# Altium schematic sheet muC.SchDoc
size A3; Organization: asdf; Address1: asdf; Revision: 1
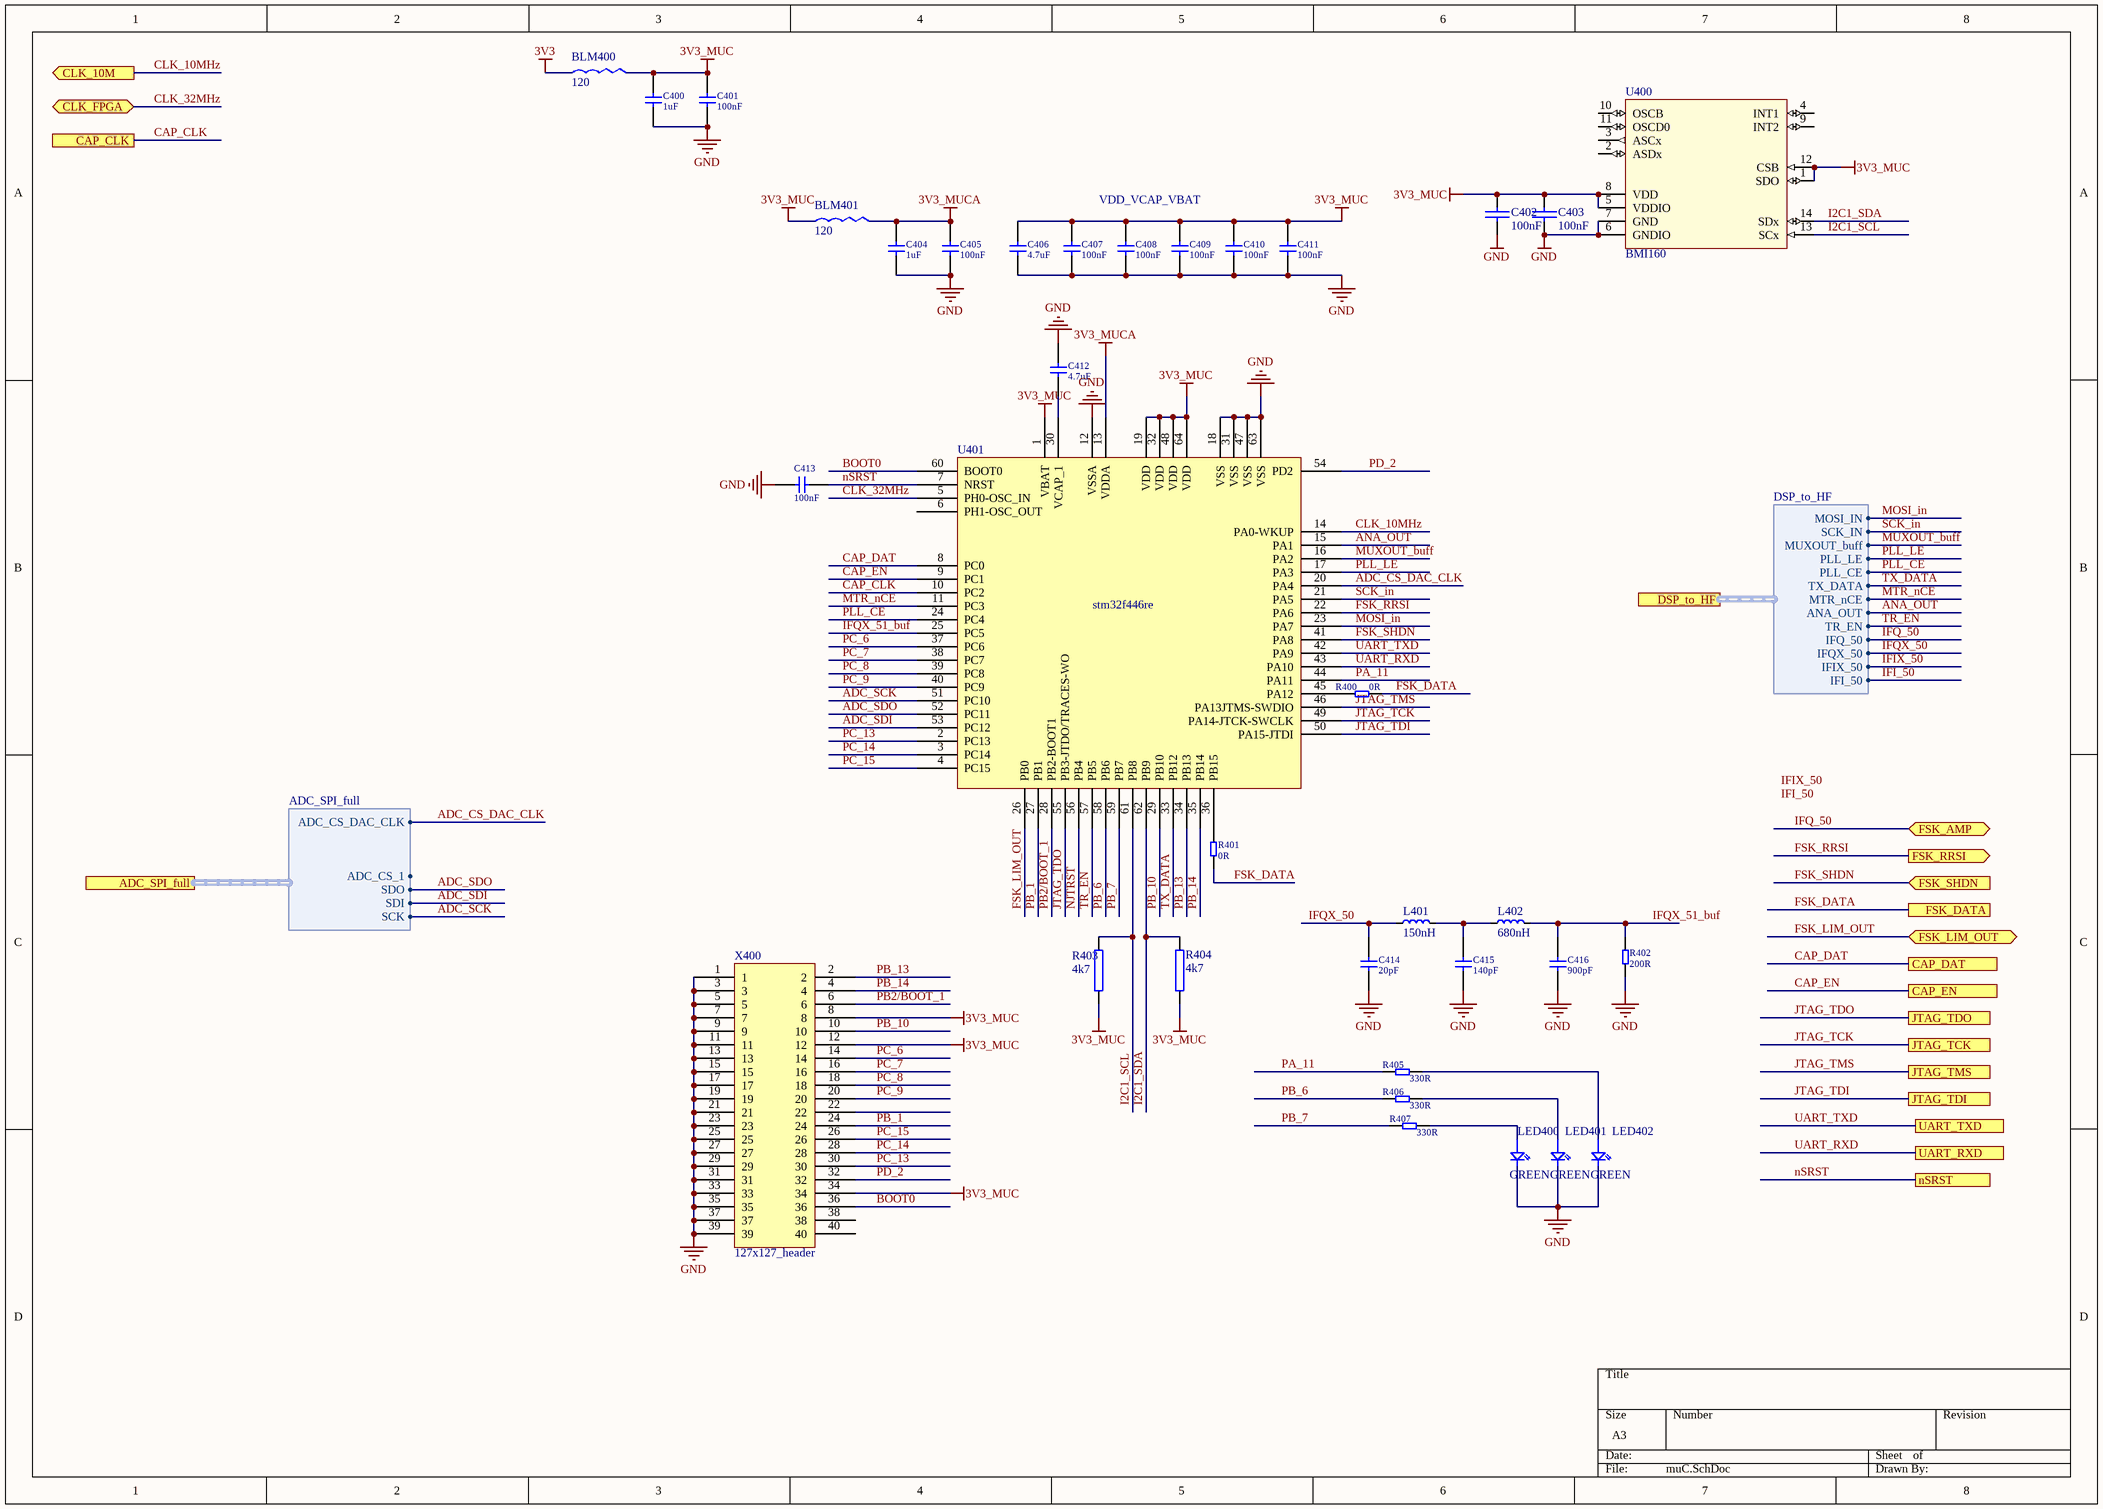
[diagram p0: muC.SchDoc]

## Parts
BLM400  FerriteBeat  [BLM18SG121TN1]  (value not drawn)
BLM401  FerriteBeat  [BLM18SG121TN1]  (value not drawn)
C400  value 1uF  [C_SMD_0603]  (hidden comment: SMD capacitor)
C401  value 100nF  [C_SMD_0402]  (hidden comment: SMD capacitor)
C402  100nF  [0402RN]
C403  100nF  [0402RN]
C404  value 1uF  [C_SMD_0603]  (hidden comment: SMD capacitor)
C405  value 100nF  [C_SMD_0402]  (hidden comment: SMD capacitor)
C406  value 4.7uF  [C_SMD_0603]  (hidden comment: SMD capacitor)
C407  value 100nF  [C_SMD_0402]  (hidden comment: SMD capacitor)
C408  value 100nF  [C_SMD_0402]  (hidden comment: SMD capacitor)
C409  value 100nF  [C_SMD_0402]  (hidden comment: SMD capacitor)
C410  value 100nF  [C_SMD_0402]  (hidden comment: SMD capacitor)
C411  value 100nF  [C_SMD_0402]  (hidden comment: SMD capacitor)
C412  value 4.7uF  [C_SMD_0603]  (hidden comment: SMD capacitor)
C413  value 100nF  [C_SMD_0402]  (hidden comment: SMD capacitor)
C414  value 20pF  [C_SMD_0402]  (hidden comment: SMD capacitor)
C415  value 140pF  [C_SMD_0402]  (hidden comment: SMD capacitor)
C416  value 900pF  [C_SMD_0402]  (hidden comment: SMD capacitor)
L401  150nH  [L_0805]
L402  680nH  [L_0805]
LED400  KPHHS-1005  [R_SMD_0402]  (value not drawn)
LED401  KPHHS-1005  [R_SMD_0402]  (value not drawn)
LED402  KPHHS-1005  [R_SMD_0402]  (value not drawn)
R400  value 0R  [R_SMD_0402]  (hidden comment: SMD Resistor)
R401  value 0R  [R_SMD_0402]  (hidden comment: SMD Resistor)
R402  value 200R  [R_SMD_0402]  (hidden comment: SMD Resistor)
R403  4k7  [0402RN]
R404  4k7  [0402RN]
R405  value 330R  [R_SMD_0402]  (hidden comment: SMD Resistor)
R406  value 330R  [R_SMD_0402]  (hidden comment: SMD Resistor)
R407  value 330R  [R_SMD_0402]  (hidden comment: SMD Resistor)
U400  BMI160  [BMI160]
U401  stm32f446re  [LQFP64]
X400  127x127_header  [Header_127x127_40PIN]

## Ports
ADC_SPI_full (harness ADC_SPI_full), CAP_CLK, CAP_DAT, CAP_EN, CLK_10M (out), CLK_FPGA (bidir), DSP_to_HF (harness DSP_to_HF), FSK_AMP (bidir), FSK_DATA, FSK_LIM_OUT (bidir), FSK_RRSI (out), FSK_SHDN (in), JTAG_TCK, JTAG_TDI, JTAG_TDO, JTAG_TMS, nSRST, UART_RXD, UART_TXD

## Harnesses
DSP_to_HF: MOSI_IN, SCK_IN, MUXOUT_buff, PLL_LE, PLL_CE, TX_DATA, MTR_nCE, ANA_OUT, TR_EN, IFQ_50, IFQX_50, IFIX_50, IFI_50
ADC_SPI_full: ADC_CS_1, SDO, SDI, SCK, ADC_CS_DAC_CLK

## Nets
3V3: BLM400.1
3V3_MUC: BLM400.2 BLM401.1 C400.1 C401.1 C402.1 C403.1 C406.1 C407.1 C408.1 C409.1 C410.1 C411.1 R403.1 R404.1 U400.1(SDO) U400.5(VDDIO) U400.8(VDD) U400.12(CSB) U401.1(VBAT) U401.19(VDD) U401.32(VDD) U401.48(VDD) U401.64(VDD) X400.8 X400.12 X400.34
3V3_MUCA: BLM401.2 C404.1 C405.1 U401.13(VDDA)
GND: C400.2 C401.2 C402.2 C403.2 C404.2 C405.2 C406.2 C407.2 C408.2 C409.2 C410.2 C411.2 C412.2 C413.2 C414.2 C415.2 C416.2 LED400.2 LED401.2 LED402.2 R402.2 U400.6(GNDIO) U400.7(GND) U401.12(VSSA) U401.18(VSS) U401.31(VSS) U401.47(VSS) U401.63(VSS) X400.1 X400.3 X400.5 X400.7 X400.9 X400.11 X400.13 X400.15 X400.17 X400.19 X400.21 X400.23 X400.25 X400.27 X400.29 X400.31 X400.33 X400.35 X400.37 X400.39
ADC_CS_DAC_CLK: U401.20(PA4) ; port ADC_SPI_full.ADC_CS_DAC_CLK
ADC_SCK: U401.51(PC10) ; port ADC_SPI_full.SCK
ADC_SDI: U401.53(PC12) ; port ADC_SPI_full.SDI
ADC_SDO: U401.52(PC11) ; port ADC_SPI_full.SDO
ANA_OUT: U401.15(PA1) ; port DSP_to_HF.ANA_OUT
BOOT0: U401.60(BOOT0) X400.36
CAP_CLK: U401.10(PC2) ; port CAP_CLK
CAP_DAT: U401.8(PC0) ; port CAP_DAT
CAP_EN: U401.9(PC1) ; port CAP_EN
CLK_10MHz: U401.14(PA0-WKUP) ; port CLK_10M
CLK_32MHz: U401.5(PH0-OSC_IN) ; port CLK_FPGA
FSK_DATA: R400.1 R401.2 ; port FSK_DATA
FSK_LIM_OUT: U401.26(PB0) ; port FSK_LIM_OUT
FSK_RRSI: U401.22(PA6) ; port FSK_RRSI
FSK_SHDN: U401.41(PA8) ; port FSK_SHDN
I2C1_SCL: R403.2 U400.13(SCx) U401.61(PB8)
I2C1_SDA: R404.2 U400.14(SDx) U401.62(PB9)
IFI_50: port DSP_to_HF.IFI_50
IFIX_50: port DSP_to_HF.IFIX_50
IFQ_50: port FSK_AMP, port DSP_to_HF.IFQ_50
IFQX_50: C414.1 L401.2 ; port DSP_to_HF.IFQX_50
IFQX_51_buf: C416.1 L402.1 R402.1 U401.25(PC5)
JTAG_TCK: U401.49(PA14-JTCK-SWCLK) ; port JTAG_TCK
JTAG_TDI: U401.50(PA15-JTDI) ; port JTAG_TDI
JTAG_TDO: U401.55(PB3-JTDO/TRACES-WO) ; port JTAG_TDO
JTAG_TMS: U401.46(PA13JTMS-SWDIO) ; port JTAG_TMS
MOSI_in: U401.23(PA7) ; port DSP_to_HF.MOSI_IN
MTR_nCE: U401.11(PC3) ; port DSP_to_HF.MTR_nCE
MUXOUT_buff: U401.16(PA2) ; port DSP_to_HF.MUXOUT_buff
NJTRST: U401.56(PB4)
nSRST: C413.1 U401.7(NRST) ; port nSRST
PA_11: R405.1 U401.44(PA11)
PB2/BOOT_1: U401.28(PB2-BOOT1) X400.6
PB_1: U401.27(PB1) X400.24
PB_6: R406.1 U401.58(PB6)
PB_7: R407.1 U401.59(PB7)
PB_10: U401.29(PB10) X400.10
PB_13: U401.34(PB13) X400.2
PB_14: U401.35(PB14) X400.4
PC_6: U401.37(PC6) X400.14
PC_7: U401.38(PC7) X400.16
PC_8: U401.39(PC8) X400.18
PC_9: U401.40(PC9) X400.20
PC_13: U401.2(PC13) X400.30
PC_14: U401.3(PC14) X400.28
PC_15: U401.4(PC15) X400.26
PD_2: U401.54(PD2) X400.32
PLL_CE: U401.24(PC4) ; port DSP_to_HF.PLL_CE
PLL_LE: U401.17(PA3) ; port DSP_to_HF.PLL_LE
SCK_in: U401.21(PA5) ; port DSP_to_HF.SCK_IN
TR_EN: U401.57(PB5) ; port DSP_to_HF.TR_EN
TX_DATA: U401.33(PB12) ; port DSP_to_HF.TX_DATA
UART_RXD: U401.43(PA10) ; port UART_RXD
UART_TXD: U401.42(PA9) ; port UART_TXD
NetC412_1: C412.1 U401.30(VCAP_1)
NetC415_1: C415.1 L401.1 L402.2
NetLED400_1: LED400.1 R407.2
NetLED401_1: LED401.1 R406.2
NetLED402_1: LED402.1 R405.2
NetR400_2: R400.2 U401.45(PA12)
NetR401_1: R401.1 U401.36(PB15)

Not connected (* = marked no-connect by the designer): U400 2(ASDx) 3(ASCx) 4(INT1) 9(INT2) 10(OSCB) 11(OSCD0); U401 6(PH1-OSC_OUT); X400 22 38 40

## Notes on the sheet
- VDD_VCAP_VBAT
- Labels drawn without touching a wire or pin: IFI_50, IFIX_50
- (in symbol FerriteBeat) 120
- (in symbol KPHHS-1005) GREEN

## Library data of the parts
BLM400 BLM401 = FerriteBeat: BLM18SG121TN1; Link: http://www.murata.com/en-us/api/pdfdownloadapi?cate=luNoiseSupprFilteChipFerriBead&partno=BLM18SG121TN1%23
C400 C404 = C_SMD: 1uF, 0603, 6.3V, 10%, X5R; Type: X5R; Voltage Rate: *
C401 C405 C407-C411 C413 = C_SMD: 100nF, 0402, 6.3V, 10%, X5R; Type: X5R; Voltage Rate: *
C402 C403 = 100n, 0402, 16V, X7R, 5%: MLCC, X7R, 16V, 5%, 0402; Libary Name: _CAP.Schlib; Hersteller: Kemet; Bauteilenummer: C0402C104J4RACTU; Bauteilalternative: with same specifications; Part Number: 100n, 0402, 16V, X7R, 5%; Footprint Name: 0402RN.PcbLib; Footprint: 0402; quantity Multiplier: 1; Distributor1: Digikey; Teilenummer Distributor1: 399-7761-1-ND; Preis @100 Distributor1: 0,153
C406 C412 = C_SMD: 4.7uF, 0603, 6.3V, 10%, X5R; Type: X5R; Voltage Rate: *
C414 = C_SMD: 20pF, 0402, 6.3V, 10%, X5R; Type: X5R; Voltage Rate: 6.3V
C415 = C_SMD: 140pF, 0402, 6.3V, 10%, X5R; Type: X5R; Voltage Rate: 6.3V
C416 = C_SMD: 900pF, 0402, 6.3V, 10%, X5R; Type: X5R; Voltage Rate: 6.3V
L401 = 744761215A: 744761215A,150nH Inductor, Würth Elektorn
L402 = 744761268A: 744761268A, 680nH
R400 R401 = R_SMD: 0R,0402
R402 = R_SMD: 200R, 0402, 1%
R403 R404 = 4k7, 0402, 1%, 0.063W, 50V: 1%, 0.063W, 50V, 0402; Libary Name: _RES.Schlib; Part Number: 4k7, 0402, 1%, 0.063W, 50V; Footprint Name: 0402RN.Pcblib; Footprint: 0402; quantity Multiplier: 1; Distributor1: Digikey; Preis @100 Distributor1: 0,0056
R405-R407 = R_SMD: 330R, 0402, 1%
U400 = Sensor BMI160: Bosch Accelerometer and Gyro; I2C & SPI; Libary Name: bosch.SchLib; Part Number: Sensor BMI160; Footprint Name: bosch.PcbLib; Footprint: BMI!60; Hersteller: Bosch; Bauteilenummer: BMI160; quantity Multiplier: 1; DatenblattLink: https://ae-bst.resource.bosch.com/media/_tech/media/datasheets/BST-BMI160-DS000-07.pdf; Distributor1: Digikey; Teilenummer Distributor1: 828-1057-1-ND; Preis @100 Distributor1: 1,3; Distributor2: Mouser; Teilenummer Distributor2: 262-BMI160; Preis @100 Distributor2: 2,46
U401 = stm32f446re: 32uC; OrderingNumber: STM32F446RET6; HelpURL: http://www.st.com/content/st_com/en/products/microcontrollers/stm32-32-bit-arm-cortex-mcus/stm32f4-series/stm32f446/stm32f446re.html
X400 = Header_2x20_127mm: 127x127_header_throughole, 2x20
LED400-LED402 = KPHHS-1005: Link: http://datasheet.octopart.com/KPHHS1005SURCK-Kingbright-datasheet-10853925.pdf